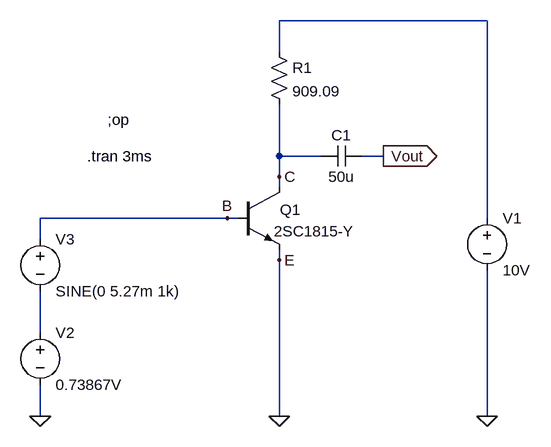
[diagram p0: schematic jikken1_2dengen.asc]
jikken1_2dengen.asc, the LTspice schematic file:
Version 4
SHEET 1 880 680
WIRE 592 -112 272 -112
WIRE 272 -64 272 -112
WIRE 272 96 272 16
WIRE 336 96 272 96
WIRE 432 96 400 96
WIRE 272 128 272 96
WIRE 272 144 272 128
WIRE 192 192 -96 192
WIRE 208 192 192 192
WIRE 592 192 592 -112
WIRE -96 224 -96 192
WIRE 272 256 272 240
WIRE -96 368 -96 304
WIRE -96 496 -96 448
WIRE 272 496 272 256
WIRE 592 496 592 272
FLAG -96 496 0
FLAG 272 496 0
FLAG 592 496 0
FLAG 272 256 E
FLAG 272 128 C
FLAG 192 192 B
FLAG 432 96 Vout
IOPIN 432 96 Out
DATAFLAG 48 192 "Ib(Q1)"
DATAFLAG 272 384 "Ie(Q1)"
DATAFLAG 272 48 ""
DATAFLAG 272 -112 "I(R1)"
SYMBOL npn 208 144 R0
WINDOW 0 65 35 Left 2
SYMATTR InstName Q1
SYMATTR Value 2SC1815-Y
SYMBOL voltage 592 176 R0
SYMATTR InstName V1
SYMATTR Value 10V
SYMBOL res 256 -80 R0
SYMATTR InstName R1
SYMATTR Value 909.09
SYMBOL voltage -96 352 R0
SYMATTR InstName V2
SYMATTR Value 0.73867V
SYMBOL voltage -96 208 R0
WINDOW 123 0 0 Left 0
WINDOW 39 0 0 Left 0
SYMATTR InstName V3
SYMATTR Value SINE(0 5.27m 1k)
SYMBOL cap 400 80 R90
WINDOW 0 0 32 VBottom 2
WINDOW 3 32 32 VTop 2
SYMATTR InstName C1
SYMATTR Value 50u
TEXT 8 40 Left 2 !;op
TEXT -24 96 Left 2 !.tran 3ms

The netlist it stands for:
* jikken1_2dengen.asc
Q1 C B 0 0 2SC1815-Y
V1 N001 0 10V
R1 N001 C 909.09
V2 N002 0 0.73867V
V3 B N002 SINE(0 5.27m 1k)
C1 Vout C 50u
.model NPN NPN
.model PNP PNP
.lib standard.bjt
;op
.tran 3ms
.backanno
.end